# Altium schematic sheet F2D08U-A1G1-EC1_F2D08U-A1G1-EC.schdoc
size 124 x 99 mm
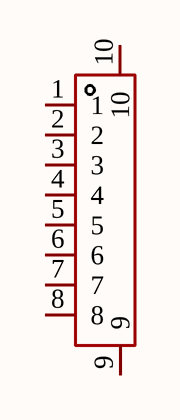
[diagram p0: F2D08U-A1G1-EC1_F2D08U-A1G1-EC.schdoc]

## Parts
FPC?  F2D08U-A1G1-EC  [FPC-SMD_8P-P0.50_FPC-0.5-8P-HYH2.0]  (value not drawn)

## Nets

Not connected (* = marked no-connect by the designer): FPC? 1 2 3 4 5 6 7 8 9 10

## Library data of the parts
FPC? = F2D08U-A1G1-EC: Manufacturer: CHIN-BAN(勤本); Add into BOM: yes; Number of Contacts: 8P; Pitch: 0.5mm; FFC, FCB Thickness: 0.3mm; Symbol: F2D08U-A1G1-EC; Device: F2D08U-A1G1-EC; LCSC Part Name: 双侧触点/上下接 P数:8P 间距:0.5mm; Supplier Part: C49232664; Manufacturer Part: F2D08U-A1G1-EC; Supplier Footprint: SMD,P=0.5mm,卧贴; JLCPCB Part Class: Extended Part; Datasheet: https://item.szlcsc.com/datasheet/F2D08U-A1G1-EC/51645733.html; Supplier: LCSC; Convert to PCB: yes; Locking Feature: -; Contact Type: 双侧触点/上下接; Mounting Type: 卧贴; Height Above Board: 2mm; Contact Material: 铜合金; Contact Plating: -; Operating Temperature: -; Rated Voltage (Max): -